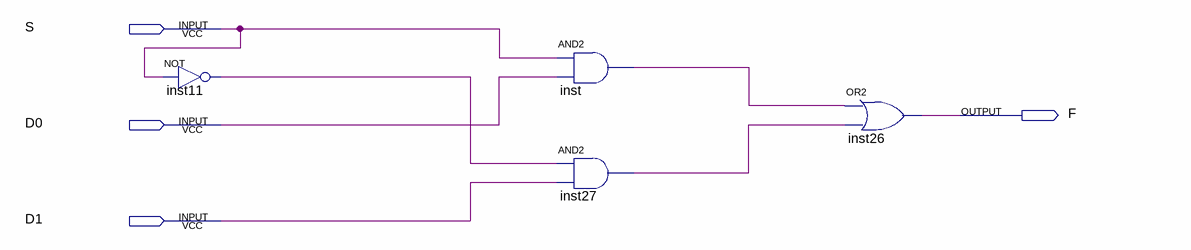
[diagram p0: schematic sheet]
// Quartus schematic No1107_1.bdf as structural Verilog: 4 symbols, 4 pins
module No1107_1 (
  input  S,
  input  D0,
  input  D1,
  output F
);

  wire inst11_out, inst27_out, inst_out;

  not inst11 (inst11_out, S);
  and inst (inst_out, S, D0);
  and inst27 (inst27_out, inst11_out, D1);
  or inst26 (F, inst_out, inst27_out);
endmodule
